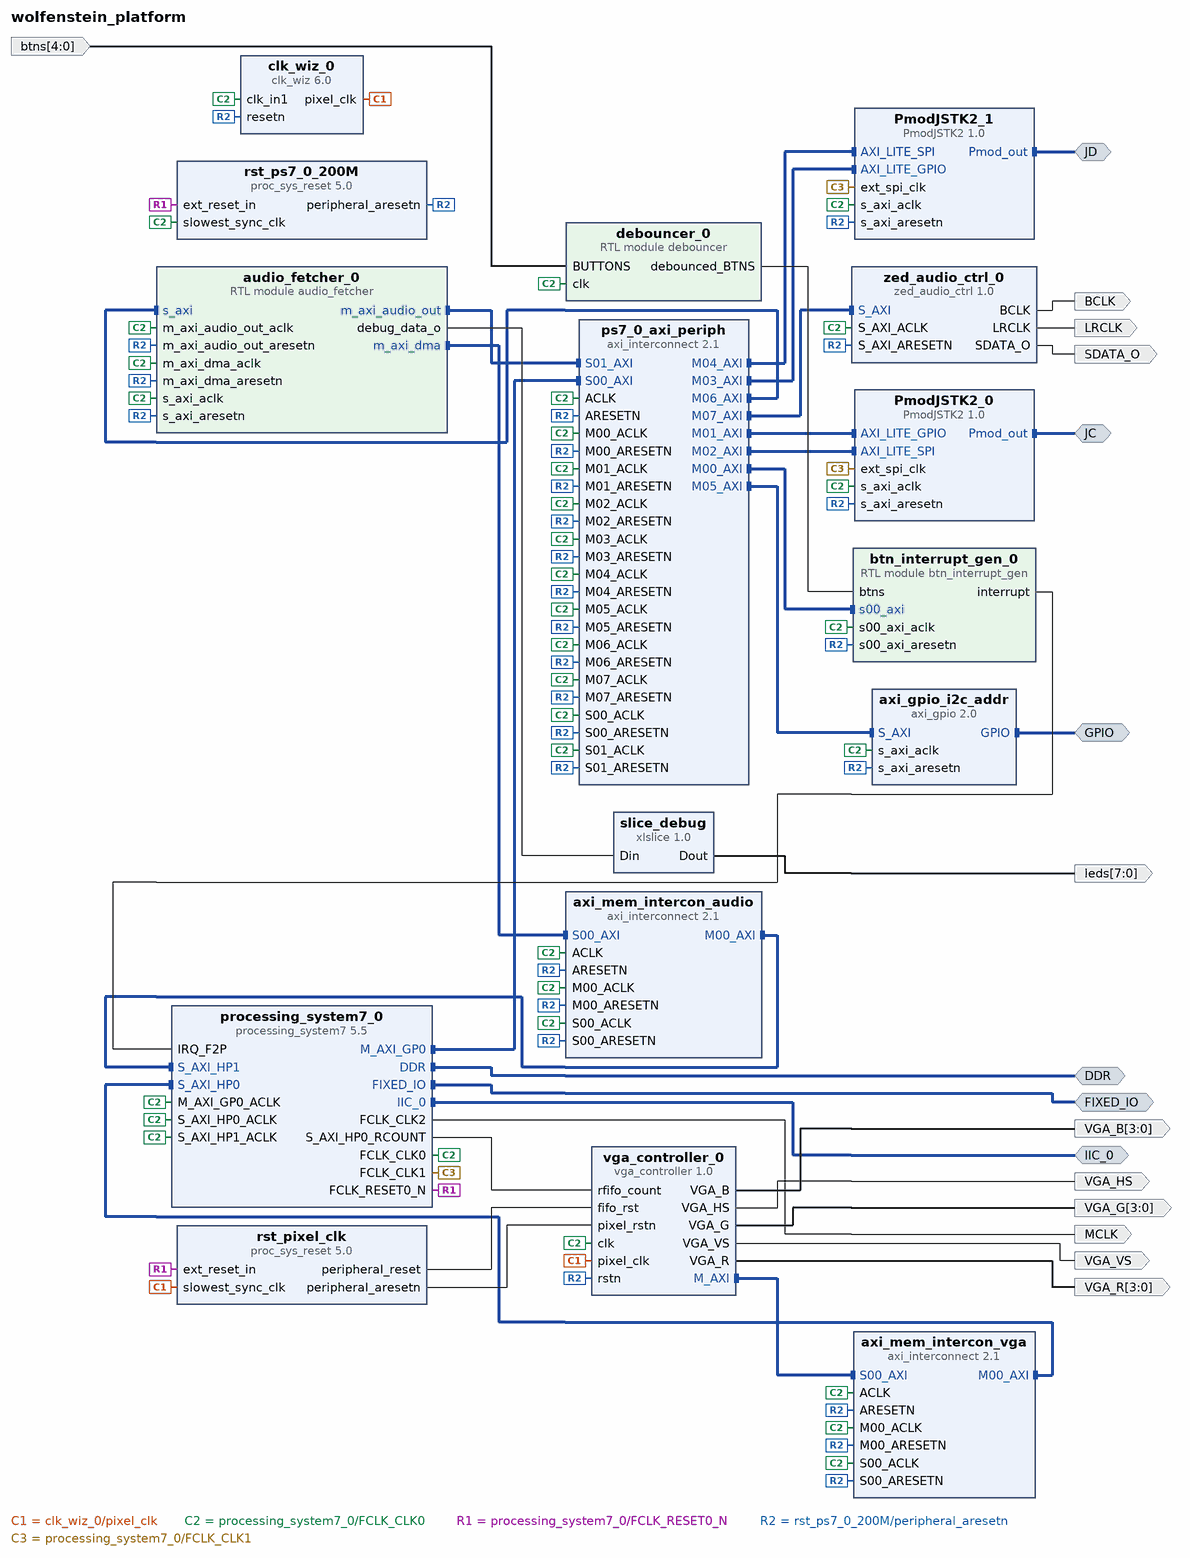
[diagram p0: block diagram of the top level]
# Vivado block design wolfenstein_platform, xc7z020clg484-1, Vivado 2020.2
create_bd_design wolfenstein_platform

create_bd_intf_port -mode Master -vlnv xilinx.com:interface:ddrx_rtl:1.0 DDR
create_bd_intf_port -mode Master -vlnv xilinx.com:display_processing_system7:fixedio_rtl:1.0 FIXED_IO
create_bd_intf_port -mode Master -vlnv digilentinc.com:interface:pmod_rtl:1.0 JC
create_bd_intf_port -mode Master -vlnv digilentinc.com:interface:pmod_rtl:1.0 JD
create_bd_intf_port -mode Master -vlnv xilinx.com:interface:iic_rtl:1.0 IIC_0
create_bd_intf_port -mode Master -vlnv xilinx.com:interface:gpio_rtl:1.0 GPIO
create_bd_port -dir O VGA_HS
create_bd_port -dir O VGA_VS
create_bd_port -dir O -from 3 -to 0 VGA_B
create_bd_port -dir O -from 3 -to 0 VGA_G
create_bd_port -dir O -from 3 -to 0 VGA_R
create_bd_port -dir I -from 4 -to 0 btns
create_bd_port -dir O -type clk MCLK
set_property -dict {CONFIG.FREQ_HZ 10000000} [get_bd_ports MCLK]
create_bd_port -dir O SDATA_O
create_bd_port -dir O LRCLK
create_bd_port -dir O BCLK
create_bd_port -dir O -from 7 -to 0 leds

create_bd_cell -type ip -vlnv user.org:user:vga_controller:1.0 vga_controller_0
set_property -dict [list \
  CONFIG.h_back_porch 48 \
  CONFIG.h_front_porch 16 \
  CONFIG.h_sync_pulse 96 \
  CONFIG.horizontal_length 640 \
  CONFIG.image_buffer1_baseaddr 0x00900000 \
  CONFIG.v_back_porch 33 \
  CONFIG.v_front_porch 10 \
  CONFIG.v_sync_polarity {"0"} \
  CONFIG.v_sync_pulse 2 \
  CONFIG.vertical_length 480 \
] [get_bd_cells vga_controller_0]
create_bd_cell -type ip -vlnv xilinx.com:ip:clk_wiz:6.0 clk_wiz_0
set_property -dict [list \
  CONFIG.CLKOUT1_JITTER 238.195 \
  CONFIG.CLKOUT1_PHASE_ERROR 205.969 \
  CONFIG.CLKOUT1_REQUESTED_OUT_FREQ 25.17598 \
  CONFIG.CLKOUT2_JITTER 261.903 \
  CONFIG.CLKOUT2_PHASE_ERROR 257.885 \
  CONFIG.CLKOUT2_REQUESTED_OUT_FREQ 16 \
  CONFIG.CLKOUT2_USED false \
  CONFIG.CLK_OUT1_PORT pixel_clk \
  CONFIG.CLK_OUT2_PORT pmod_clk \
  CONFIG.MMCM_CLKFBOUT_MULT_F 38.000 \
  CONFIG.MMCM_CLKOUT0_DIVIDE_F 43.125 \
  CONFIG.MMCM_CLKOUT1_DIVIDE 1 \
  CONFIG.MMCM_DIVCLK_DIVIDE 7 \
  CONFIG.NUM_OUT_CLKS 1 \
  CONFIG.RESET_PORT resetn \
  CONFIG.RESET_TYPE ACTIVE_LOW \
  CONFIG.USE_LOCKED false \
] [get_bd_cells clk_wiz_0]
create_bd_cell -type ip -vlnv xilinx.com:ip:processing_system7:5.5 processing_system7_0
set_property -dict [list \
  CONFIG.PCW_APU_PERIPHERAL_FREQMHZ 200 \
  CONFIG.PCW_ENET0_ENET0_IO {MIO 16 .. 27} \
  CONFIG.PCW_ENET0_GRP_MDIO_ENABLE 1 \
  CONFIG.PCW_ENET0_GRP_MDIO_IO {MIO 52 .. 53} \
  CONFIG.PCW_ENET0_PERIPHERAL_ENABLE 1 \
  CONFIG.PCW_ENET0_RESET_ENABLE 0 \
  CONFIG.PCW_ENET_RESET_ENABLE 1 \
  CONFIG.PCW_ENET_RESET_SELECT {Share reset pin} \
  CONFIG.PCW_EN_CLK1_PORT 1 \
  CONFIG.PCW_EN_CLK2_PORT 1 \
  CONFIG.PCW_FPGA0_PERIPHERAL_FREQMHZ 200 \
  CONFIG.PCW_FPGA1_PERIPHERAL_FREQMHZ 16 \
  CONFIG.PCW_FPGA2_PERIPHERAL_FREQMHZ 10 \
  CONFIG.PCW_FPGA_FCLK1_ENABLE 1 \
  CONFIG.PCW_FPGA_FCLK2_ENABLE 1 \
  CONFIG.PCW_GPIO_MIO_GPIO_ENABLE 1 \
  CONFIG.PCW_GPIO_MIO_GPIO_IO MIO \
  CONFIG.PCW_I2C0_I2C0_IO EMIO \
  CONFIG.PCW_I2C0_PERIPHERAL_ENABLE 1 \
  CONFIG.PCW_I2C_PERIPHERAL_FREQMHZ 33.333332 \
  CONFIG.PCW_I2C_RESET_ENABLE 1 \
  CONFIG.PCW_I2C_RESET_SELECT {Share reset pin} \
  CONFIG.PCW_IRQ_F2P_INTR 1 \
  CONFIG.PCW_PERIPHERAL_BOARD_PRESET part0 \
  CONFIG.PCW_PRESET_BANK1_VOLTAGE {LVCMOS 1.8V} \
  CONFIG.PCW_QSPI_GRP_SINGLE_SS_ENABLE 1 \
  CONFIG.PCW_QSPI_GRP_SINGLE_SS_IO {MIO 1 .. 6} \
  CONFIG.PCW_QSPI_PERIPHERAL_ENABLE 1 \
  CONFIG.PCW_QSPI_PERIPHERAL_FREQMHZ 200.000000 \
  CONFIG.PCW_QSPI_QSPI_IO {MIO 1 .. 6} \
  CONFIG.PCW_SD0_GRP_CD_ENABLE 1 \
  CONFIG.PCW_SD0_GRP_CD_IO {MIO 47} \
  CONFIG.PCW_SD0_GRP_WP_ENABLE 1 \
  CONFIG.PCW_SD0_GRP_WP_IO {MIO 46} \
  CONFIG.PCW_SD0_PERIPHERAL_ENABLE 1 \
  CONFIG.PCW_SD0_SD0_IO {MIO 40 .. 45} \
  CONFIG.PCW_SDIO_PERIPHERAL_FREQMHZ 50 \
  CONFIG.PCW_SINGLE_QSPI_DATA_MODE x4 \
  CONFIG.PCW_TTC0_PERIPHERAL_ENABLE 1 \
  CONFIG.PCW_TTC0_TTC0_IO EMIO \
  CONFIG.PCW_UART1_PERIPHERAL_ENABLE 1 \
  CONFIG.PCW_UART1_UART1_IO {MIO 48 .. 49} \
  CONFIG.PCW_UART_PERIPHERAL_FREQMHZ 50 \
  CONFIG.PCW_UIPARAM_DDR_FREQ_MHZ 533.333313 \
  CONFIG.PCW_UIPARAM_DDR_PARTNO {MT41J128M16 HA-15E} \
  CONFIG.PCW_USB0_PERIPHERAL_ENABLE 1 \
  CONFIG.PCW_USB0_RESET_ENABLE 0 \
  CONFIG.PCW_USB0_USB0_IO {MIO 28 .. 39} \
  CONFIG.PCW_USB_RESET_ENABLE 1 \
  CONFIG.PCW_USB_RESET_SELECT {Share reset pin} \
  CONFIG.PCW_USE_FABRIC_INTERRUPT 1 \
  CONFIG.PCW_USE_S_AXI_HP0 1 \
  CONFIG.PCW_USE_S_AXI_HP1 1 \
  CONFIG.preset ZedBoard \
] [get_bd_cells processing_system7_0]
# 515 more settings of processing_system7_0 are not shown: defaults, MIO pin electricals, DDR timing, and values the tool derives
create_bd_cell -type ip -vlnv xilinx.com:ip:axi_interconnect:2.1 ps7_0_axi_periph
set_property -dict {CONFIG.NUM_MI 8 CONFIG.NUM_SI 2} [get_bd_cells ps7_0_axi_periph]
create_bd_cell -type ip -vlnv xilinx.com:ip:proc_sys_reset:5.0 rst_ps7_0_200M
create_bd_cell -type ip -vlnv xilinx.com:ip:proc_sys_reset:5.0 rst_pixel_clk
create_bd_cell -type ip -vlnv xilinx.com:ip:axi_interconnect:2.1 axi_mem_intercon_vga
set_property -dict {CONFIG.NUM_MI 1} [get_bd_cells axi_mem_intercon_vga]
create_bd_cell -type ip -vlnv digilentinc.com:IP:PmodJSTK2:1.0 PmodJSTK2_1
create_bd_cell -type ip -vlnv digilentinc.com:IP:PmodJSTK2:1.0 PmodJSTK2_0
create_bd_cell -type ip -vlnv xilinx.com:user:zed_audio_ctrl:1.0 zed_audio_ctrl_0
create_bd_cell -type ip -vlnv xilinx.com:ip:axi_gpio:2.0 axi_gpio_i2c_addr
set_property -dict {CONFIG.C_GPIO_WIDTH 2} [get_bd_cells axi_gpio_i2c_addr]
create_bd_cell -type ip -vlnv xilinx.com:ip:axi_interconnect:2.1 axi_mem_intercon_audio
set_property -dict {CONFIG.NUM_MI 1} [get_bd_cells axi_mem_intercon_audio]
create_bd_cell -type module -reference debouncer debouncer_0
create_bd_cell -type ip -vlnv xilinx.com:ip:xlslice:1.0 slice_debug
set_property -dict {CONFIG.DIN_FROM 7 CONFIG.DOUT_WIDTH 8} [get_bd_cells slice_debug]
create_bd_cell -type module -reference btn_interrupt_gen btn_interrupt_gen_0
create_bd_cell -type module -reference audio_fetcher audio_fetcher_0
set_property -dict {CONFIG.ZED_AUDIO_CTRL_ADDR 1136721920} [get_bd_cells audio_fetcher_0]

# ---- connections ----

connect_bd_intf_net [get_bd_intf_pins ps7_0_axi_periph/M07_AXI] [get_bd_intf_pins zed_audio_ctrl_0/S_AXI]
connect_bd_intf_net [get_bd_intf_pins ps7_0_axi_periph/M01_AXI] [get_bd_intf_pins PmodJSTK2_0/AXI_LITE_GPIO]
connect_bd_intf_net [get_bd_intf_pins audio_fetcher_0/m_axi_dma] [get_bd_intf_pins axi_mem_intercon_audio/S00_AXI]
connect_bd_intf_net [get_bd_intf_pins audio_fetcher_0/m_axi_audio_out] [get_bd_intf_pins ps7_0_axi_periph/S01_AXI]
connect_bd_intf_net [get_bd_intf_ports DDR] [get_bd_intf_pins processing_system7_0/DDR]
connect_bd_intf_net [get_bd_intf_ports JC] [get_bd_intf_pins PmodJSTK2_0/Pmod_out]
connect_bd_intf_net [get_bd_intf_pins ps7_0_axi_periph/M04_AXI] [get_bd_intf_pins PmodJSTK2_1/AXI_LITE_SPI]
connect_bd_intf_net [get_bd_intf_pins ps7_0_axi_periph/M03_AXI] [get_bd_intf_pins PmodJSTK2_1/AXI_LITE_GPIO]
connect_bd_intf_net [get_bd_intf_pins ps7_0_axi_periph/M05_AXI] [get_bd_intf_pins axi_gpio_i2c_addr/S_AXI]
connect_bd_intf_net [get_bd_intf_pins vga_controller_0/M_AXI] [get_bd_intf_pins axi_mem_intercon_vga/S00_AXI]
connect_bd_intf_net [get_bd_intf_ports IIC_0] [get_bd_intf_pins processing_system7_0/IIC_0]
connect_bd_intf_net [get_bd_intf_pins processing_system7_0/M_AXI_GP0] [get_bd_intf_pins ps7_0_axi_periph/S00_AXI]
connect_bd_intf_net [get_bd_intf_pins ps7_0_axi_periph/M00_AXI] [get_bd_intf_pins btn_interrupt_gen_0/s00_axi]
connect_bd_intf_net [get_bd_intf_ports FIXED_IO] [get_bd_intf_pins processing_system7_0/FIXED_IO]
connect_bd_intf_net -intf_net i2c_addr_gpio_GPIO [get_bd_intf_ports GPIO] [get_bd_intf_pins axi_gpio_i2c_addr/GPIO]
connect_bd_intf_net [get_bd_intf_ports JD] [get_bd_intf_pins PmodJSTK2_1/Pmod_out]
connect_bd_intf_net -intf_net axi_mem_intercon_1_M00_AXI [get_bd_intf_pins axi_mem_intercon_audio/M00_AXI] [get_bd_intf_pins processing_system7_0/S_AXI_HP1]
connect_bd_intf_net [get_bd_intf_pins ps7_0_axi_periph/M06_AXI] [get_bd_intf_pins audio_fetcher_0/s_axi]
connect_bd_intf_net [get_bd_intf_pins ps7_0_axi_periph/M02_AXI] [get_bd_intf_pins PmodJSTK2_0/AXI_LITE_SPI]
connect_bd_intf_net -intf_net axi_mem_intercon_M00_AXI [get_bd_intf_pins axi_mem_intercon_vga/M00_AXI] [get_bd_intf_pins processing_system7_0/S_AXI_HP0]
connect_bd_net [get_bd_pins clk_wiz_0/pixel_clk] [get_bd_pins vga_controller_0/pixel_clk] [get_bd_pins rst_pixel_clk/slowest_sync_clk]
connect_bd_net [get_bd_pins vga_controller_0/VGA_HS] [get_bd_ports VGA_HS]
connect_bd_net [get_bd_pins vga_controller_0/VGA_VS] [get_bd_ports VGA_VS]
connect_bd_net [get_bd_pins vga_controller_0/VGA_B] [get_bd_ports VGA_B]
connect_bd_net [get_bd_pins vga_controller_0/VGA_G] [get_bd_ports VGA_G]
connect_bd_net [get_bd_pins vga_controller_0/VGA_R] [get_bd_ports VGA_R]
connect_bd_net [get_bd_pins processing_system7_0/FCLK_CLK0] \
  [get_bd_pins clk_wiz_0/clk_in1] [get_bd_pins vga_controller_0/clk] [get_bd_pins processing_system7_0/M_AXI_GP0_ACLK] \
  [get_bd_pins ps7_0_axi_periph/S00_ACLK] [get_bd_pins rst_ps7_0_200M/slowest_sync_clk] \
  [get_bd_pins ps7_0_axi_periph/M00_ACLK] [get_bd_pins ps7_0_axi_periph/ACLK] [get_bd_pins ps7_0_axi_periph/M01_ACLK] \
  [get_bd_pins ps7_0_axi_periph/M02_ACLK] [get_bd_pins ps7_0_axi_periph/M03_ACLK] [get_bd_pins ps7_0_axi_periph/M04_ACLK] \
  [get_bd_pins processing_system7_0/S_AXI_HP0_ACLK] [get_bd_pins axi_mem_intercon_vga/ACLK] \
  [get_bd_pins axi_mem_intercon_vga/S00_ACLK] [get_bd_pins axi_mem_intercon_vga/M00_ACLK] \
  [get_bd_pins PmodJSTK2_1/s_axi_aclk] [get_bd_pins PmodJSTK2_0/s_axi_aclk] [get_bd_pins axi_gpio_i2c_addr/s_axi_aclk] \
  [get_bd_pins ps7_0_axi_periph/M05_ACLK] [get_bd_pins ps7_0_axi_periph/M06_ACLK] [get_bd_pins zed_audio_ctrl_0/S_AXI_ACLK] \
  [get_bd_pins ps7_0_axi_periph/M07_ACLK] [get_bd_pins axi_mem_intercon_audio/S00_ACLK] \
  [get_bd_pins processing_system7_0/S_AXI_HP1_ACLK] [get_bd_pins axi_mem_intercon_audio/M00_ACLK] \
  [get_bd_pins axi_mem_intercon_audio/ACLK] [get_bd_pins ps7_0_axi_periph/S01_ACLK] [get_bd_pins debouncer_0/clk] \
  [get_bd_pins btn_interrupt_gen_0/s00_axi_aclk] [get_bd_pins audio_fetcher_0/s_axi_aclk] \
  [get_bd_pins audio_fetcher_0/m_axi_audio_out_aclk] [get_bd_pins audio_fetcher_0/m_axi_dma_aclk]
connect_bd_net [get_bd_pins processing_system7_0/FCLK_RESET0_N] [get_bd_pins rst_ps7_0_200M/ext_reset_in] [get_bd_pins rst_pixel_clk/ext_reset_in]
connect_bd_net [get_bd_pins rst_ps7_0_200M/peripheral_aresetn] \
  [get_bd_pins ps7_0_axi_periph/S00_ARESETN] [get_bd_pins ps7_0_axi_periph/M00_ARESETN] \
  [get_bd_pins ps7_0_axi_periph/ARESETN] [get_bd_pins ps7_0_axi_periph/M01_ARESETN] \
  [get_bd_pins ps7_0_axi_periph/M02_ARESETN] [get_bd_pins ps7_0_axi_periph/M03_ARESETN] \
  [get_bd_pins ps7_0_axi_periph/M04_ARESETN] [get_bd_pins clk_wiz_0/resetn] [get_bd_pins vga_controller_0/rstn] \
  [get_bd_pins axi_mem_intercon_vga/S00_ARESETN] [get_bd_pins axi_mem_intercon_vga/M00_ARESETN] \
  [get_bd_pins axi_mem_intercon_vga/ARESETN] [get_bd_pins PmodJSTK2_1/s_axi_aresetn] [get_bd_pins PmodJSTK2_0/s_axi_aresetn] \
  [get_bd_pins axi_gpio_i2c_addr/s_axi_aresetn] [get_bd_pins ps7_0_axi_periph/M05_ARESETN] \
  [get_bd_pins ps7_0_axi_periph/M06_ARESETN] [get_bd_pins zed_audio_ctrl_0/S_AXI_ARESETN] \
  [get_bd_pins ps7_0_axi_periph/M07_ARESETN] [get_bd_pins axi_mem_intercon_audio/S00_ARESETN] \
  [get_bd_pins axi_mem_intercon_audio/M00_ARESETN] [get_bd_pins axi_mem_intercon_audio/ARESETN] \
  [get_bd_pins ps7_0_axi_periph/S01_ARESETN] [get_bd_pins btn_interrupt_gen_0/s00_axi_aresetn] \
  [get_bd_pins audio_fetcher_0/s_axi_aresetn] [get_bd_pins audio_fetcher_0/m_axi_audio_out_aresetn] \
  [get_bd_pins audio_fetcher_0/m_axi_dma_aresetn]
connect_bd_net [get_bd_pins rst_pixel_clk/peripheral_reset] [get_bd_pins vga_controller_0/fifo_rst]
connect_bd_net [get_bd_pins rst_pixel_clk/peripheral_aresetn] [get_bd_pins vga_controller_0/pixel_rstn]
connect_bd_net [get_bd_pins processing_system7_0/S_AXI_HP0_RCOUNT] [get_bd_pins vga_controller_0/rfifo_count]
connect_bd_net [get_bd_pins processing_system7_0/FCLK_CLK1] [get_bd_pins PmodJSTK2_0/ext_spi_clk] [get_bd_pins PmodJSTK2_1/ext_spi_clk]
connect_bd_net [get_bd_pins processing_system7_0/FCLK_CLK2] [get_bd_ports MCLK]
connect_bd_net [get_bd_pins zed_audio_ctrl_0/SDATA_O] [get_bd_ports SDATA_O]
connect_bd_net [get_bd_pins zed_audio_ctrl_0/LRCLK] [get_bd_ports LRCLK]
connect_bd_net [get_bd_pins zed_audio_ctrl_0/BCLK] [get_bd_ports BCLK]
connect_bd_net [get_bd_ports btns] [get_bd_pins debouncer_0/BUTTONS]
connect_bd_net [get_bd_pins btn_interrupt_gen_0/interrupt] [get_bd_pins processing_system7_0/IRQ_F2P]
connect_bd_net [get_bd_pins debouncer_0/debounced_BTNS] [get_bd_pins btn_interrupt_gen_0/btns]
connect_bd_net [get_bd_pins slice_debug/Dout] [get_bd_ports leds]
connect_bd_net [get_bd_pins audio_fetcher_0/debug_data_o] [get_bd_pins slice_debug/Din]

# ---- address map ----
assign_bd_address -offset 0x40000000 -range 4K -target_address_space [get_bd_addr_spaces audio_fetcher_0/m_axi_audio_out] [get_bd_addr_segs PmodJSTK2_0/AXI_LITE_GPIO/Reg0]
assign_bd_address -offset 0x40001000 -range 4K -target_address_space [get_bd_addr_spaces audio_fetcher_0/m_axi_audio_out] [get_bd_addr_segs PmodJSTK2_1/AXI_LITE_GPIO/Reg0]
assign_bd_address -offset 0x40010000 -range 64K -target_address_space [get_bd_addr_spaces audio_fetcher_0/m_axi_audio_out] [get_bd_addr_segs PmodJSTK2_0/AXI_LITE_SPI/Reg0]
assign_bd_address -offset 0x40020000 -range 64K -target_address_space [get_bd_addr_spaces audio_fetcher_0/m_axi_audio_out] [get_bd_addr_segs PmodJSTK2_1/AXI_LITE_SPI/Reg0]
assign_bd_address -offset 0x41210000 -range 64K -target_address_space [get_bd_addr_spaces audio_fetcher_0/m_axi_audio_out] [get_bd_addr_segs axi_gpio_i2c_addr/S_AXI/Reg]
assign_bd_address -offset 0x43C00000 -range 64K -target_address_space [get_bd_addr_spaces audio_fetcher_0/m_axi_audio_out] [get_bd_addr_segs audio_fetcher_0/s_axi/reg0]
assign_bd_address -offset 0x43C10000 -range 64K -target_address_space [get_bd_addr_spaces audio_fetcher_0/m_axi_audio_out] [get_bd_addr_segs zed_audio_ctrl_0/S_AXI/reg0]
assign_bd_address -offset 0x43C20000 -range 64K -target_address_space [get_bd_addr_spaces audio_fetcher_0/m_axi_audio_out] [get_bd_addr_segs btn_interrupt_gen_0/s00_axi/reg0]
assign_bd_address -offset 0x00000000 -range 512M -target_address_space [get_bd_addr_spaces audio_fetcher_0/m_axi_dma] [get_bd_addr_segs processing_system7_0/S_AXI_HP1/HP1_DDR_LOWOCM]
assign_bd_address -offset 0x40000000 -range 4K -target_address_space [get_bd_addr_spaces processing_system7_0/Data] [get_bd_addr_segs PmodJSTK2_0/AXI_LITE_GPIO/Reg0]
assign_bd_address -offset 0x40001000 -range 4K -target_address_space [get_bd_addr_spaces processing_system7_0/Data] [get_bd_addr_segs PmodJSTK2_1/AXI_LITE_GPIO/Reg0]
assign_bd_address -offset 0x40010000 -range 64K -target_address_space [get_bd_addr_spaces processing_system7_0/Data] [get_bd_addr_segs PmodJSTK2_0/AXI_LITE_SPI/Reg0]
assign_bd_address -offset 0x40020000 -range 64K -target_address_space [get_bd_addr_spaces processing_system7_0/Data] [get_bd_addr_segs PmodJSTK2_1/AXI_LITE_SPI/Reg0]
assign_bd_address -offset 0x41210000 -range 64K -target_address_space [get_bd_addr_spaces processing_system7_0/Data] [get_bd_addr_segs axi_gpio_i2c_addr/S_AXI/Reg]
assign_bd_address -offset 0x43C00000 -range 64K -target_address_space [get_bd_addr_spaces processing_system7_0/Data] [get_bd_addr_segs audio_fetcher_0/s_axi/reg0]
assign_bd_address -offset 0x43C10000 -range 64K -target_address_space [get_bd_addr_spaces processing_system7_0/Data] [get_bd_addr_segs zed_audio_ctrl_0/S_AXI/reg0]
assign_bd_address -offset 0x43C20000 -range 64K -target_address_space [get_bd_addr_spaces processing_system7_0/Data] [get_bd_addr_segs btn_interrupt_gen_0/s00_axi/reg0]
assign_bd_address -offset 0x00000000 -range 512M -target_address_space [get_bd_addr_spaces vga_controller_0/M_AXI] [get_bd_addr_segs processing_system7_0/S_AXI_HP0/HP0_DDR_LOWOCM]

validate_bd_design
save_bd_design
